# EAGLE design SimpleSeqArd_a10_added_missing_resistors_debug8 (EAGLE 9.1.2)
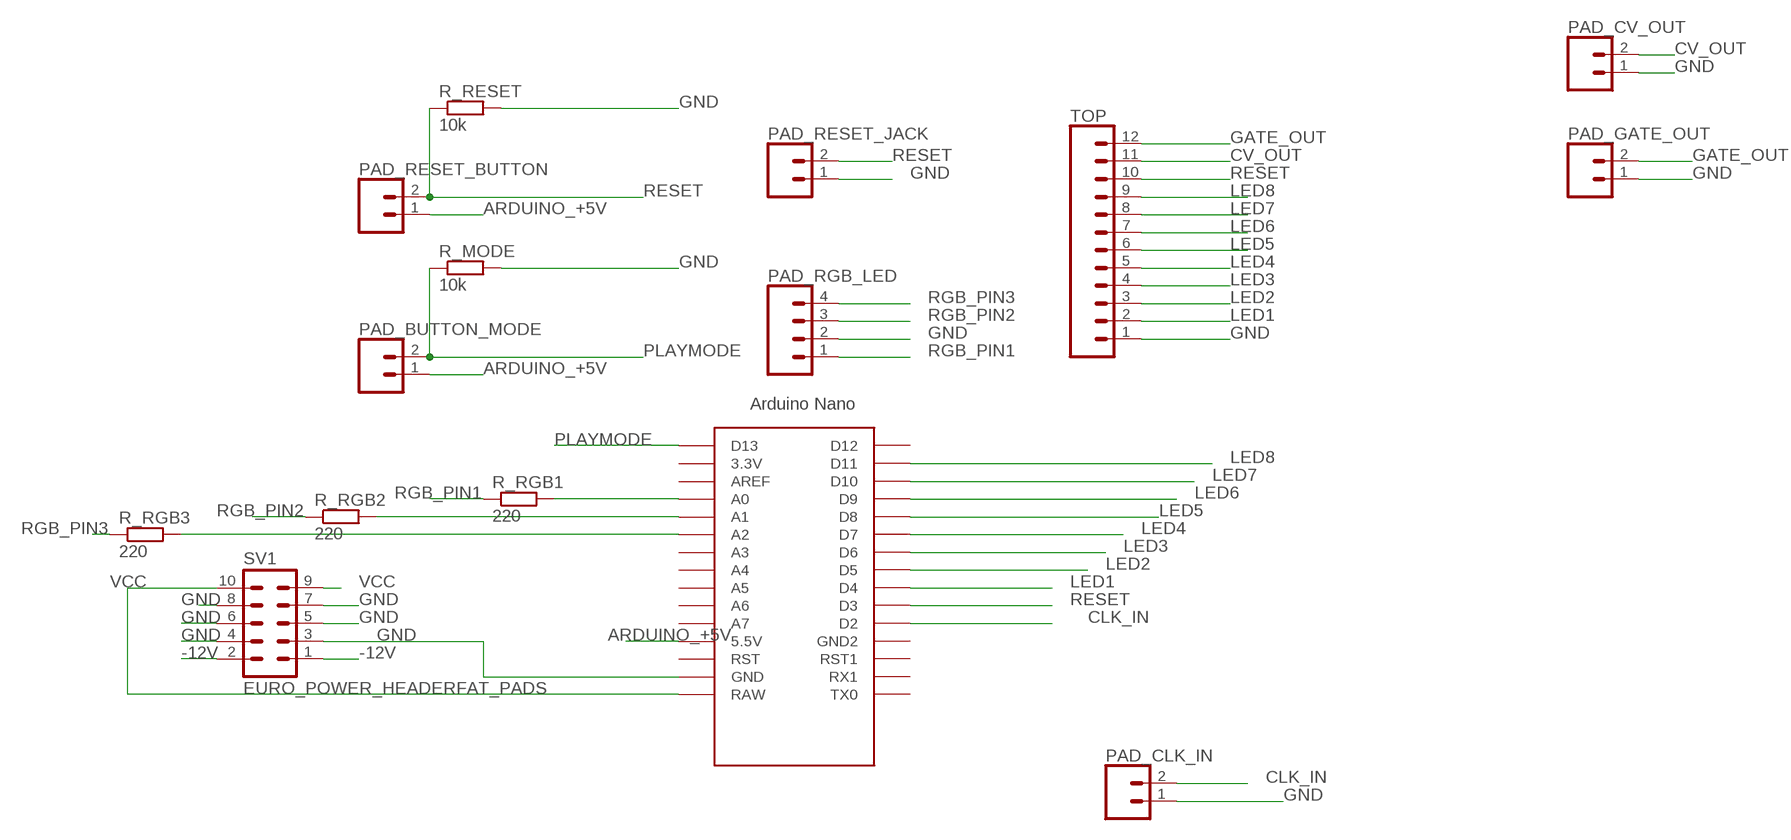
[diagram p0: schematic, sheet 1]

## Parts
PAD_BUTTON_MODE  CONN_02PTH3  [1X02_LONGPADS]
PAD_CLK_IN  CONN_02PTH3  [1X02_LONGPADS]
PAD_CV_OUT  CONN_02PTH3  [1X02_LONGPADS]
PAD_GATE_OUT  CONN_02PTH3  [1X02_LONGPADS]
PAD_RESET_BUTTON  CONN_02PTH3  [1X02_LONGPADS]
PAD_RESET_JACK  CONN_02PTH3  [1X02_LONGPADS]
PAD_RGB_LED  CONN_04LONGPADS  [1X04_LONGPADS]
R_MODE  10k  RESISTORVERTICAL  [VERTICAL_RESISTOR]
R_RESET  10k  RESISTORVERTICAL  [VERTICAL_RESISTOR]
R_RGB1  220  RESISTORVERTICAL  [VERTICAL_RESISTOR]
R_RGB2  220  RESISTORVERTICAL  [VERTICAL_RESISTOR]
R_RGB3  220  RESISTORVERTICAL  [VERTICAL_RESISTOR]
SV1  EURO_POWER_HEADERFAT_PADS  [EURO_PWR_HEADER_FAT]
TOP  CONN_12LONGPADS  [1X12_LONGPADS]
U$1  NANO  [NANO]

## Nets
-12V: SV1.1 SV1.2
ARDUINO_+5V: PAD_BUTTON_MODE.1 PAD_RESET_BUTTON.1 U$1.5V(5.5V)
CLK_IN: PAD_CLK_IN.2 U$1.D2
CV_OUT: PAD_CV_OUT.2 TOP.11
GATE_OUT: PAD_GATE_OUT.2 TOP.12
GND: PAD_CLK_IN.1 PAD_CV_OUT.1 PAD_GATE_OUT.1 PAD_RESET_JACK.1 PAD_RGB_LED.2 R_MODE.2 R_RESET.2 SV1.3 SV1.4 SV1.5 SV1.6 SV1.7 SV1.8 TOP.1 U$1.GND
LED1: TOP.2 U$1.D4
LED2: TOP.3 U$1.D5
LED3: TOP.4 U$1.D6
LED4: TOP.5 U$1.D7
LED5: TOP.6 U$1.D8
LED6: TOP.7 U$1.D9
LED7: TOP.8 U$1.D10
LED8: TOP.9 U$1.D11
N$1: R_RGB1.2 U$1.A0
N$2: R_RGB2.2 U$1.A1
N$3: R_RGB3.2 U$1.A2
PLAYMODE: PAD_BUTTON_MODE.2 R_MODE.1 U$1.D13
RESET: PAD_RESET_BUTTON.2 PAD_RESET_JACK.2 R_RESET.1 TOP.10 U$1.D3
RGB_PIN1: PAD_RGB_LED.1 R_RGB1.1
RGB_PIN2: PAD_RGB_LED.3 R_RGB2.1
RGB_PIN3: PAD_RGB_LED.4 R_RGB3.1
VCC: SV1.9 SV1.10 U$1.RAW
Unconnected: U$1.3.3V U$1.A3 U$1.A4 U$1.A5 U$1.A6 U$1.A7 U$1.AREF U$1.D12 U$1.GND1(GND2) U$1.RST U$1.RST1 U$1.RX1 U$1.TX0

## Library data of the parts
PAD_BUTTON_MODE PAD_CLK_IN PAD_CV_OUT PAD_GATE_OUT PAD_RESET_BUTTON PAD_RESET_JACK = SparkFun-Connectors:CONN_02: Multi connection point. Often used as Generic Header-pin footprint for 0.1 inch spaced/style header connections On any of the 0.1 inch spaced packages, you can populate with these: Break Away Headers - Straight <https://www.sparkfun.com/products/116> (PRT-00116) Break Away Male Headers - Right Angle <https://www.sparkfun.com/products/553> (PRT-00553) Female Headers <https://www.sparkfun.com/products/115> (PRT-00115) Break Away Headers - Machine Pin <https://www.sparkfun.com/products/117> (PRT-00117) Break Away Female Headers - Swiss Machine Pin <https://www.sparkfun.com/products/743> (PRT-00743) For SCREWTERMINALS and SPRING TERMINALS visit here: Screw Terimnals on SparkFun.com <https://www.sparkfun.com/search/results?term=Screw+Terminals> (5mm/3.5mm/2.54mm spacing) This device is also useful as a general connection point to wire up your design to another part of your project. Our various solder wires solder well into these plated through hole pads. Hook-Up Wire - Assortment (Stranded, 22 AWG) <https://www.sparkfun.com/products/11375> (PRT-11375) Hook-Up Wire - Assortment (Solid Core, 22 AWG) <https://www.sparkfun.com/products/11367> (PRT-11367) View the entire wire category on our website here <https://www.sparkfun.com/categories/141> Special notes: Molex polarized connector foot print use with: PRT-08233 with associated crimp pins and housings. 2.54_SCREWTERM for use with PRT-10571. 3.5mm Screw Terminal footprints for PRT-08084 5mm Screw Terminal footprints for use with PRT-08432
PAD_RGB_LED = SparkFun-Connectors:CONN_04: Multi connection point. Often used as Generic Header-pin footprint for 0.1 inch spaced/style header connections On any of the 0.1 inch spaced packages, you can populate with these: Break Away Headers - Straight <https://www.sparkfun.com/products/116> (PRT-00116) Break Away Male Headers - Right Angle <https://www.sparkfun.com/products/553> (PRT-00553) Female Headers <https://www.sparkfun.com/products/115> (PRT-00115) Break Away Headers - Machine Pin <https://www.sparkfun.com/products/117> (PRT-00117) Break Away Female Headers - Swiss Machine Pin <https://www.sparkfun.com/products/743> (PRT-00743) For SCREWTERMINALS and SPRING TERMINALS visit here: Screw Terimnals on SparkFun.com <https://www.sparkfun.com/search/results?term=Screw+Terminals> (5mm/3.5mm/2.54mm spacing) This device is also useful as a general connection point to wire up your design to another part of your project. Our various solder wires solder well into these plated through hole pads. Hook-Up Wire - Assortment (Stranded, 22 AWG) <https://www.sparkfun.com/products/11375> (PRT-11375) Hook-Up Wire - Assortment (Solid Core, 22 AWG) <https://www.sparkfun.com/products/11367> (PRT-11367) View the entire wire category on our website here <https://www.sparkfun.com/categories/141> Special notes: Molex polarized connector foot print use with SKU : PRT-08231 with associated crimp pins and housings. 1MM SMD Version SKU: PRT-10208; PROD_ID: CONN-09696
R_MODE R_RESET R_RGB1-R_RGB3 = MusicThingModular:RESISTOR: Standard resistor, various versions
SV1 = MusicThingModular:EURO_POWER_HEADER: Power Header 10 pin power header for Eurorack Power Supplies Variants with fatter pads for easier soldering, and the LOCK variant which has 5mil offset pins to hold the component in place before soldering
TOP = SparkFun-Connectors:CONN_12: Multi connection point. Often used as Generic Header-pin footprint for 0.1 inch spaced/style header connections On any of the 0.1 inch spaced packages, you can populate with these: Break Away Headers - Straight <https://www.sparkfun.com/products/116> (PRT-00116) Break Away Male Headers - Right Angle <https://www.sparkfun.com/products/553> (PRT-00553) Female Headers <https://www.sparkfun.com/products/115> (PRT-00115) Break Away Headers - Machine Pin <https://www.sparkfun.com/products/117> (PRT-00117) Break Away Female Headers - Swiss Machine Pin <https://www.sparkfun.com/products/743> (PRT-00743) For SCREWTERMINALS and SPRING TERMINALS visit here: Screw Terimnals on SparkFun.com <https://www.sparkfun.com/search/results?term=Screw+Terminals> (5mm/3.5mm/2.54mm spacing) This device is also useful as a general connection point to wire up your design to another part of your project. Our various solder wires solder well into these plated through hole pads. Hook-Up Wire - Assortment (Stranded, 22 AWG) <https://www.sparkfun.com/products/11375> (PRT-11375) Hook-Up Wire - Assortment (Solid Core, 22 AWG) <https://www.sparkfun.com/products/11367> (PRT-11367) View the entire wire category on our website here <https://www.sparkfun.com/categories/141> Special notes: Molex polarized connector foot print use with SKU : PRT-08231 with associated crimp pins and housings. 1MM SMD Version SKU: PRT-10208 NOTES ON THE VARIANTS LOCK and LOCK_LONGPADS... This footprint was designed to help hold the alignment of a through-hole component (i.e. 6-pin header) while soldering it into place. You may notice that each hole has been shifted either up or down by 0.005 of an inch from it's more standard position (which is a perfectly straight line). This slight alteration caused the pins (the squares in the middle) to touch the edges of the holes. Because they are alternating, it causes a "brace" to hold the component in place. 0.005 has proven to be the perfect amount of "off-center" position when using our standard breakaway headers. Although looks a little odd when you look at the bare footprint, once you have a header in there, the alteration is very hard to notice. Also,if you push a header all the way into place, it is covered up entirely on the bottom side.
U$1 = Arduino-clone_EDITED:NANO: Arduino Nano

## Board
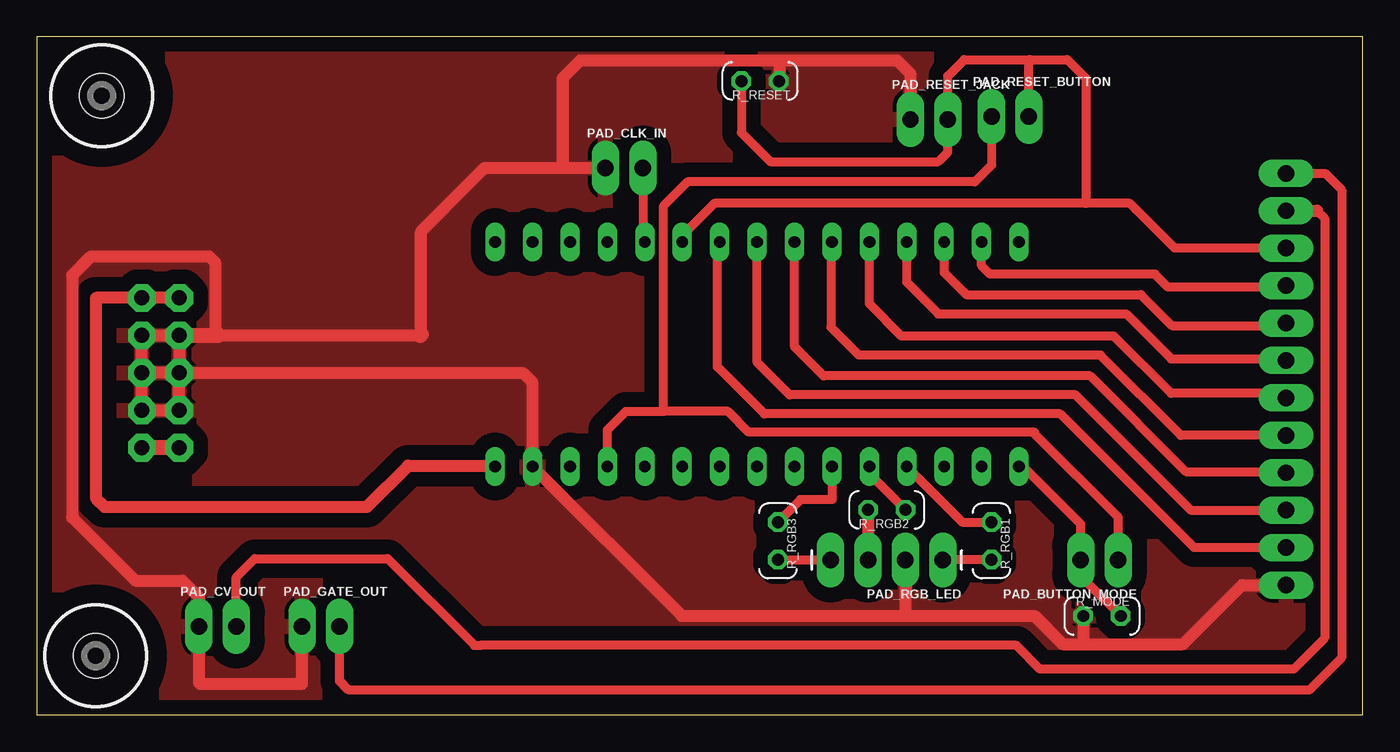
[diagram p1: board, top side]
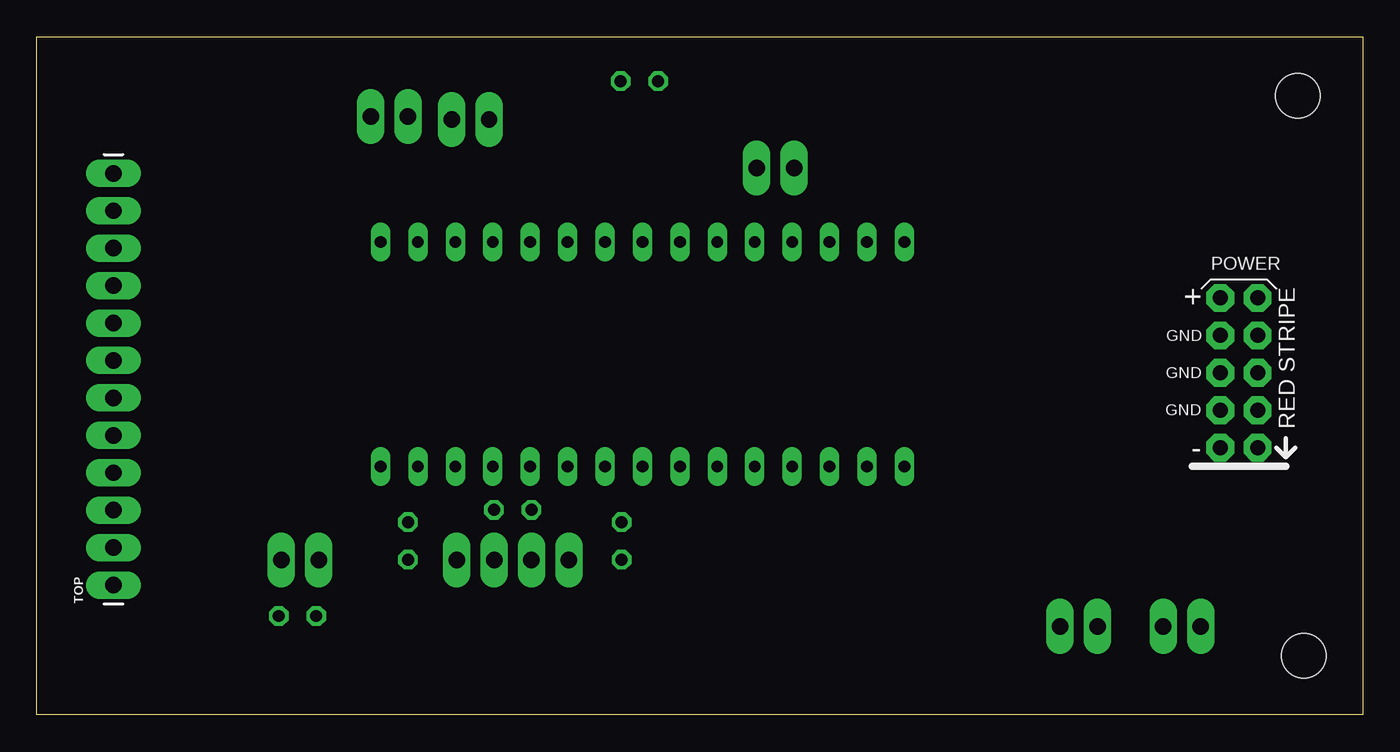
[diagram p2: board, bottom side, seen from below]

Size 90 x 46 mm. Coordinates in mm from the lower left corner, seen from the top.
Outline: 0,0 90,0 90,46 0,46 0,0
Copper layers (1*16): Top 0.035mm / dielectric 1.5mm / Bottom 0.035mm
Design rules "default": minimum track width 6mil, minimum drill 0.35mm, track to track 6mil, track to pad 6mil, pad to pad 6mil, via to via 6mil, smd to smd 6mil, copper to edge 40mil, drill to drill 6mil, minimum pad ring 10mil, minimum via ring 8mil, stop-mask expansion 4mil, vias tented up to drill 0mil, thermal gap 10mil

### Footprints (pad centres in the part's own frame; a part is rotated, then mirrored left to right if it is on the bottom)
DRIL-3 = hole 3: 0,0
1X02_LONGPADS = drill 1.118 pad 1.88 long: 1 0,0; 2 2.54,0
1X04_LONGPADS = drill 1.118 pad 1.88 long: 1 0,0; 2 2.54,0; 3 5.08,0; 4 7.62,0
VERTICAL_RESISTOR = drill 0.813 octagon: 1 -1.27,0; 2 1.27,0
EURO_PWR_HEADER_FAT = drill 1.016 pad 1.88 octagon: 1 -5.08,-1.27; 2 -5.08,1.27; 3 -2.54,-1.27; 4 -2.54,1.27; 5 0,-1.27; 6 0,1.27; 7 2.54,-1.27; 8 2.54,1.27; 9 5.08,-1.27; 10 5.08,1.27
1X12_LONGPADS = drill 1.118 pad 1.88 long: 1 0,0; 2 2.54,0; 3 5.08,0; 4 7.62,0; 5 10.16,0; 6 12.7,0; 7 15.24,0; 8 17.78,0; 9 20.32,0; 10 22.86,0; 11 25.4,0; 12 27.94,0
NANO = drill 0.8 long: 3.3V -10.16,24.13; 5V -10.16,-1.27; A0 -10.16,19.05; A1 -10.16,16.51; A2 -10.16,13.97; A3 -10.16,11.43; A4 -10.16,8.89; A5 -10.16,6.35; A6 -10.16,3.81; A7 -10.16,1.27; AREF -10.16,21.59; D2 5.08,1.27; D3 5.08,3.81; D4 5.08,6.35; D5 5.08,8.89; D6 5.08,11.43; D7 5.08,13.97; D8 5.08,16.51; D9 5.08,19.05; D10 5.08,21.59; D11 5.08,24.13; D12 5.08,26.67; D13 -10.16,26.67; GND -10.16,-6.35; GND1 5.08,-1.27; RAW -10.16,-8.89; RST -10.16,-3.81; RST1 5.08,-3.81; RX1 5.08,-6.35; TX0 5.08,-8.89

### Placement (x,y rotation side)
H1  [DRIL-3]  4.4,42 0 top
H2  [DRIL-3]  4,4 0 top
PAD_BUTTON_MODE  73.4,10.5 180 top
PAD_CLK_IN  38.6,37.1 0 top
PAD_CV_OUT  11,6 0 top
PAD_GATE_OUT  18,6 0 top
PAD_RESET_BUTTON  64.8,40.6 0 top
PAD_RESET_JACK  59.3,40.4 0 top
PAD_RGB_LED  61.5,10.5 180 top
R_MODE  72.3,6.7 180 top
R_RESET  49.1,43 0 top
R_RGB1  64.8,11.8 90 top
R_RGB2  57.7,13.9 0 top
R_RGB3  50.3,11.8 90 top
SV1  8.4,23.2 90 bottom
TOP  84.8,8.8 90 bottom
U$1  40,27 90 bottom

### Tracks (layer width: path | path; a pad name or v marks a point on that pad's centre or on a via)
-12V
  Top 1.016: SV1.2 SV1.1
ARDUINO_+5V
  Top 0.61: PAD_RESET_BUTTON.1 64.8,37.3 63.66,36.16 44.18,36.16 42.55,34.54 42.55,20.58 | PAD_BUTTON_MODE.1 73.4,13.4 67.72,19.08 | 67.72,19.08 67.72,19.16 | U$1.5V 38.73,19.33 39.98,20.58 42.55,20.58 | 42.55,20.58 46.92,20.58 48.32,19.18 67.62,19.18 67.72,19.08
CLK_IN
  Top 0.61: PAD_CLK_IN.2 41.14,32.21
  Top 0.813: 41.14,32.21 U$1.D2
CV_OUT
  Top 0.61: 86.9,34.2 87.41,33.69 87.41,5.2 85.31,3.1 68.1,3.1 66.5,4.7 30.1,4.7 29.7,4.7 23.8,10.6 14.8,10.6 13.54,9.34 PAD_CV_OUT.2
  Top 0.813: TOP.11 86.9,34.2
GATE_OUT
  Top 0.61: PAD_GATE_OUT.2 20.55,2.3 21.18,1.67 86.37,1.67 88.58,3.88 88.58,35.62 87.46,36.74 TOP.12
  Top 0.813: PAD_GATE_OUT.2
GND
  Top 0.813: SV1.5 SV1.3 SV1.4 SV1.6 | SV1.6 SV1.5 | SV1.5 SV1.7 SV1.8 SV1.6 | PAD_GATE_OUT.1 18,2.1 11.1,2.1 11,2.2 PAD_CV_OUT.1 11,8 9.9,9.1 6.7,9.1 2.4,13.4 2.4,29.8 3.7,31.1 11.7,31.1 12.1,30.7 12.1,25.94 | SV1.6 33,23.2 33.6,22.6 33.6,16.89 U$1.GND 43.79,6.7 58.8,6.7 | 50.4,44.4 50.7,44.4 58.4,44.4 59.3,43.5 PAD_RESET_JACK.1 | 50.4,44.4 50.4,43.03 R_RESET.2 | 50.4,44.4 36.9,44.4 35.7,43.2 35.7,37.2 35.6,37.1 | 12.3,25.74 26.04,25.74 | 26.1,25.8 26.1,32.8 30.4,37.1 35.6,37.1 | 58.8,6.7 67.7,6.7 69.6,4.8 71.2,4.8 | R_MODE.2 71.03,4.97 71.2,4.8 | PAD_RGB_LED.2 58.96,6.86 58.8,6.7 | 71.2,4.8 77.8,4.8 81.8,8.8 TOP.1 | 35.6,37.1 PAD_CLK_IN.1
  Top 1.016: SV1.8 12.3,25.74 12.1,25.94 | 26.04,25.74 26.1,25.8
  pour Top (isolate 1): 0.2,-0.2 0.2,46 90,46 90,0 89.8,-0.2
LED1
  Top 0.61: TOP.2 78.56,11.34 69.48,20.42 49.38,20.42 46.2,23.6 46.2,31.93 U$1.D4
LED2
  Top 0.61: TOP.3 78.32,13.88 70.5,21.7 51.1,21.7 48.89,23.91 U$1.D5
LED3
  Top 0.61: 84.72,16.5 78,16.5 71.5,23 53.4,23 51.43,24.97 U$1.D6
  Top 0.813: 84.72,16.5 TOP.4
LED4
  Top 0.61: TOP.5 77.64,18.96 72.2,24.4 55.8,24.4 53.9,26.3 53.9,32.01 U$1.D7
LED5
  Top 0.61: 84.5,21.8 77,21.8 73.1,25.7 58.7,25.7 56.51,27.89 U$1.D8
  Top 0.813: TOP.6 84.5,21.8
LED6
  Top 0.61: U$1.D9 59.05,29.35 61.2,27.2 73.94,27.2 77,24.14 84.7,24.14
  Top 0.813: 84.7,24.14 TOP.7
LED7
  Top 0.61: U$1.D10 61.59,30.01 63.1,28.5 74.95,28.5 77.05,26.4 84.62,26.4
  Top 0.813: 84.62,26.4 TOP.8
LED8
  Top 0.61: 84.7,29.02 76.78,29.02 75.9,29.9 64.71,29.9 64.13,30.48 U$1.D11
  Top 0.813: TOP.9 84.7,29.02
N$1
  Top 0.61: U$1.A0 62.82,13.07 R_RGB1.2
N$2
  Top 0.61: U$1.A1 56.51,16.36 R_RGB2.2
N$3
  Top 0.61: U$1.A2 53.97,14.63 54,14.6 51.83,14.6 R_RGB3.2
PLAYMODE
  Top 0.61: R_MODE.1 70.86,9.41 PAD_BUTTON_MODE.2 70.86,12.94 66.96,16.84 U$1.D13
RESET
  Top 0.61: TOP.10 81.3,31.66 77.24,31.66 74.6,34.3 74.2,34.7 71.2,34.7 | 71.2,34.7 46,34.7 43.81,32.51 U$1.D3 | 67.4,44.45 62.95,44.45 61.84,43.34 PAD_RESET_JACK.2 61.84,38.17 61.2,37.53 49.8,37.53 47.83,39.5 R_RESET.1 | PAD_RESET_BUTTON.2 67.34,44.39 67.4,44.45 | 67.4,44.45 69.95,44.45 71.2,43.2 71.2,34.7
RGB_PIN1
  Top 0.61: R_RGB1.1 61.53,10.53 PAD_RGB_LED.1
RGB_PIN2
  Top 0.813: R_RGB2.1 PAD_RGB_LED.3
RGB_PIN3
  Top 0.61: R_RGB3.1 53.85,10.53 PAD_RGB_LED.4
VCC
  Top 0.813: SV1.10 SV1.9 4,28.28 4,14.7 4.6,14.1 22.4,14.1 25.2,16.9 31.05,16.9 U$1.RAW

### Text on the board
tDocu: led1 | led2 | led3 | led4 | led5 | led6 | led7 | led8 | d12 | a1 | a0 | a ref | 3.3v | playmode | vin ard | gnd ard | rst | +5v ard | a7 | a6 | a5 | a4 | a3 | a2